# EAGLE design Laser Harp PCB (EAGLE 9.6.2)
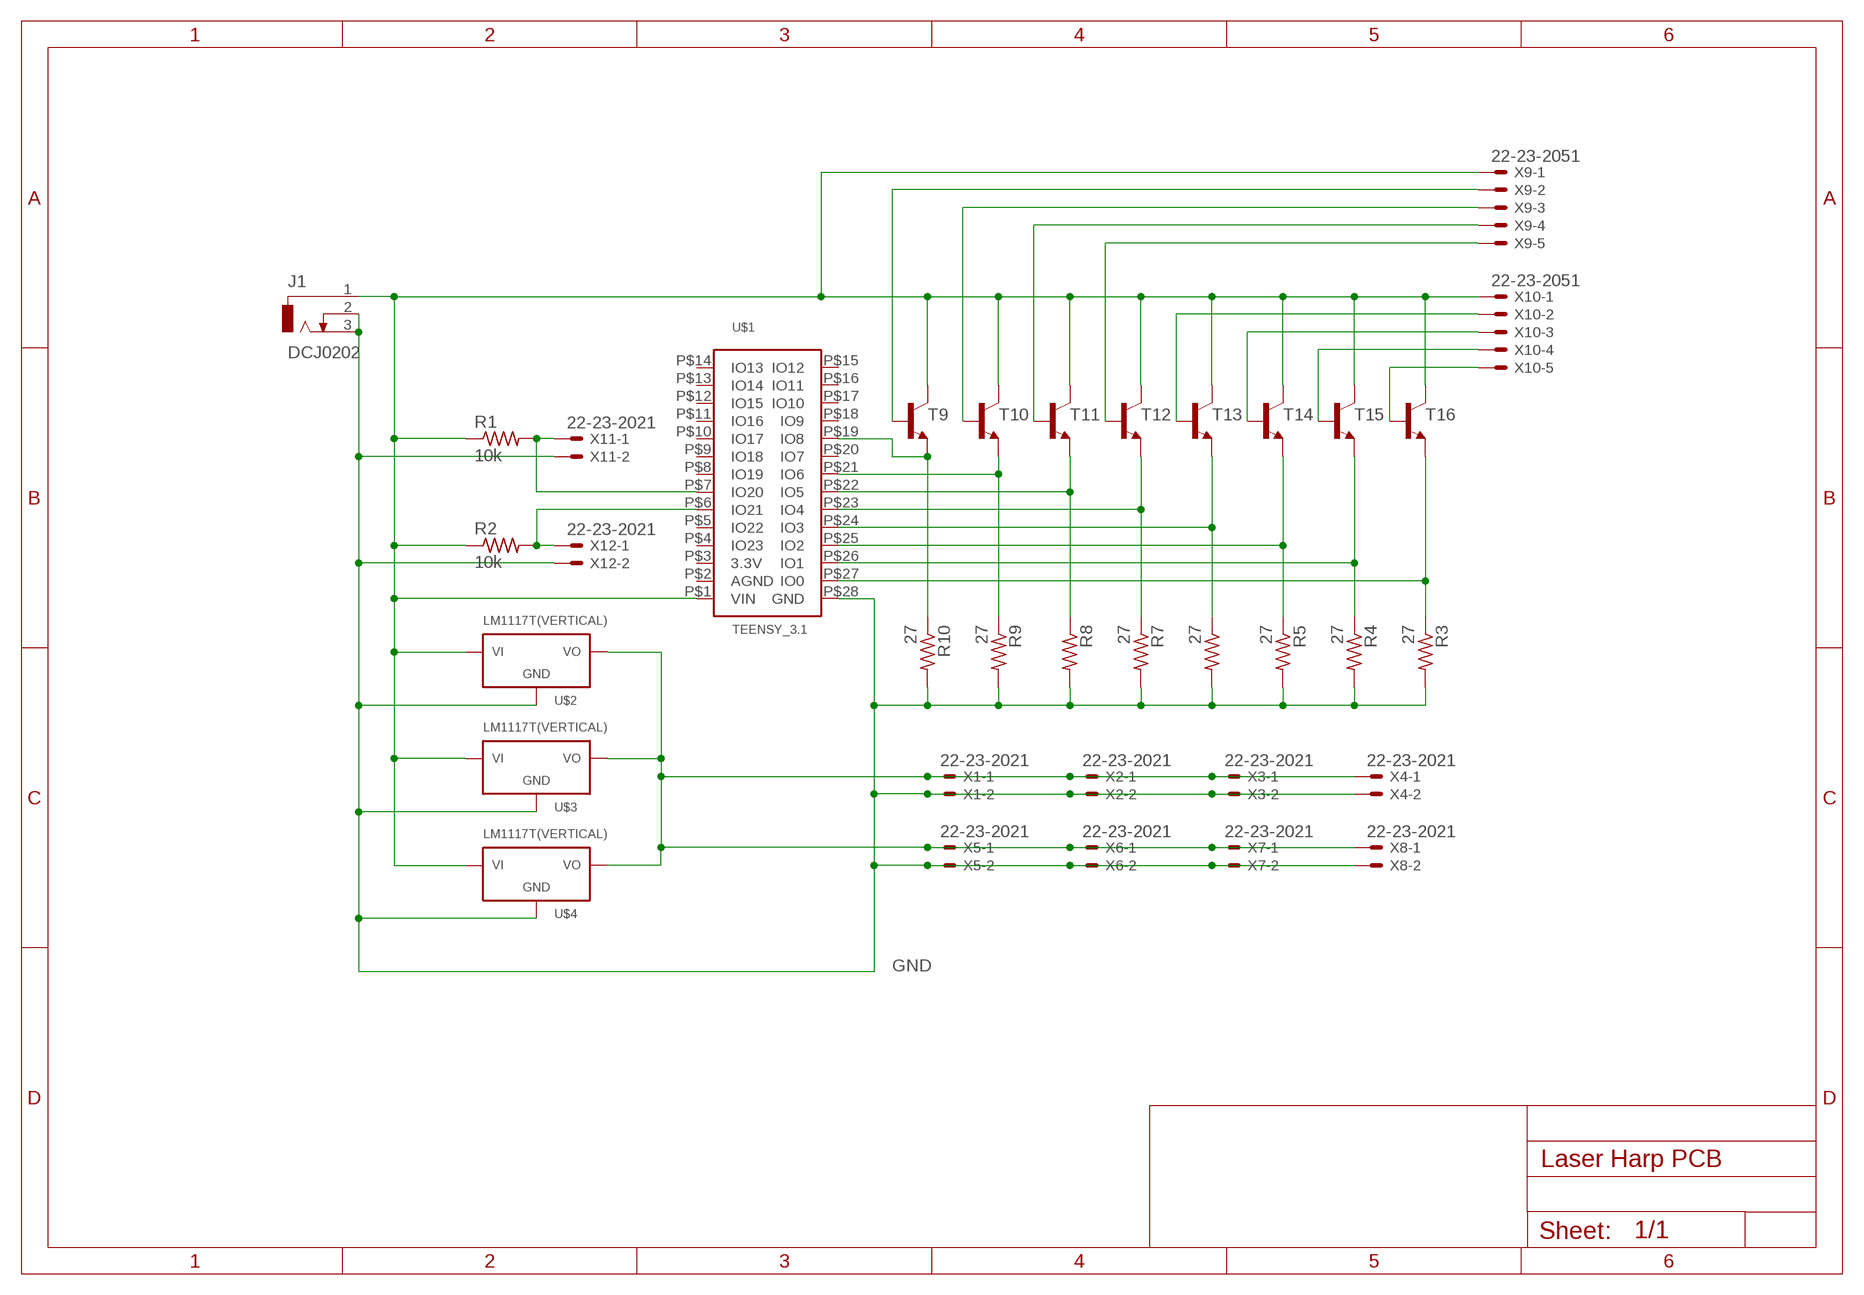
[diagram p0: schematic, sheet 1]

## Parts
J1  DCJ0202  [DCJ0202]
R1  10k  R-US_0207/7  [0207/7]
R2  10k  R-US_0207/7  [0207/7]
R3  27  R-US_0207/7  [0207/7]
R4  27  R-US_0207/7  [0207/7]
R5  27  R-US_0207/7  [0207/7]
R6  27  R-US_0207/7  [0207/7]
R7  27  R-US_0207/7  [0207/7]
R8  27  R-US_0207/7  [0207/7]
R9  27  R-US_0207/7  [0207/7]
R10  27  R-US_0207/7  [0207/7]
T9  2N3904-NPN-TO92-EBC  [TO92-EBC]
T10  2N3904-NPN-TO92-EBC  [TO92-EBC]
T11  2N3904-NPN-TO92-EBC  [TO92-EBC]
T12  2N3904-NPN-TO92-EBC  [TO92-EBC]
T13  2N3904-NPN-TO92-EBC  [TO92-EBC]
T14  2N3904-NPN-TO92-EBC  [TO92-EBC]
T15  2N3904-NPN-TO92-EBC  [TO92-EBC]
T16  2N3904-NPN-TO92-EBC  [TO92-EBC]
U$1  TEENSY_3.1  [TEENSY_3.1]
U$2  LM1117T(VERTICAL)  [317TS]
U$3  LM1117T(VERTICAL)  [317TS]
U$4  LM1117T(VERTICAL)  [317TS]
X1  22-23-2021  [22-23-2021]
X2  22-23-2021  [22-23-2021]
X3  22-23-2021  [22-23-2021]
X4  22-23-2021  [22-23-2021]
X5  22-23-2021  [22-23-2021]
X6  22-23-2021  [22-23-2021]
X7  22-23-2021  [22-23-2021]
X8  22-23-2021  [22-23-2021]
X9  22-23-2051  [22-23-2051]
X10  22-23-2051  [22-23-2051]
X11  22-23-2021  [22-23-2021]
X12  22-23-2021  [22-23-2021]

## Nets
GND: J1.2 J1.3 R3.2 R4.2 R5.2 R6.2 R7.2 R8.2 R9.2 R10.2 U$1.P$28(GND) U$2.1(GND) U$3.1(GND) U$4.1(GND) X1.2 X2.2 X3.2 X4.2 X5.2 X6.2 X7.2 X8.2 X11.2 X12.2
N$1: U$2.2(VOUT) U$3.2(VOUT) U$4.2(VOUT) X1.1 X2.1 X3.1 X4.1 X5.1 X6.1 X7.1 X8.1
N$2: J1.1 R1.1 R2.1 T9.C T10.C T11.C T12.C T13.C T14.C T15.C T16.C U$1.P$1(VIN) U$2.3(VIN) U$3.3(VIN) U$4.3(VIN) X9.1 X10.1
N$3: R3.1 T16.E U$1.P$27(IO0)
N$4: R4.1 T15.E U$1.P$26(IO1)
N$5: R5.1 T14.E U$1.P$25(IO2)
N$6: R6.1 T13.E U$1.P$24(IO3)
N$7: R7.1 T12.E U$1.P$23(IO4)
N$8: R8.1 T11.E U$1.P$22(IO5)
N$9: R9.1 T10.E U$1.P$21(IO6)
N$10: R2.2 U$1.P$6(IO21) X12.1
N$12: R1.2 U$1.P$7(IO20) X11.1
N$24: R10.1 T9.E U$1.P$19(IO8)
N$27: T9.B X9.2
N$28: T10.B X9.3
N$29: T11.B X9.4
N$30: T12.B X9.5
N$31: T13.B X10.2
N$32: T14.B X10.3
N$33: T15.B X10.4
N$34: T16.B X10.5
Unconnected: U$1.P$2(AGND) U$1.P$3(3.3V) U$1.P$4(IO23) U$1.P$5(IO22) U$1.P$8(IO19) U$1.P$9(IO18) U$1.P$10(IO17) U$1.P$11(IO16) U$1.P$12(IO15) U$1.P$13(IO14) U$1.P$14(IO13) U$1.P$15(IO12) U$1.P$16(IO11) U$1.P$17(IO10) U$1.P$18(IO9) U$1.P$20(IO7)

## Library data of the parts
J1 = con-jack:DCJ0202: DC POWER JACK Source: DCJ0202.pdf; OC_FARNELL: unknown; OC_NEWARK: unknown
R1-R10 = rcl:R-US_: RESISTOR, American symbol; SPICEPREFIX: R
T9-T16 = transistor-neu-to92:*-NPN-: NPN Transistror
U$1 = Laser Harp PCB:TEENSY_3.1
U$2-U$4 = Laser Harp PCB:LM1117T(VERTICAL)
X1-X8 X11 X12 = con-molex:22-23-2021: .100" (2.54mm) Center Header - 2 Pin; MF: MOLEX; MPN: 22-23-2021; OC_FARNELL: 1462926; OC_NEWARK: 25C3832
X9 X10 = con-molex:22-23-2051: .100" (2.54mm) Center Header - 5 Pin; MF: MOLEX; MPN: 22-23-2051; OC_FARNELL: 1462952; OC_NEWARK: 38C9178

## Board
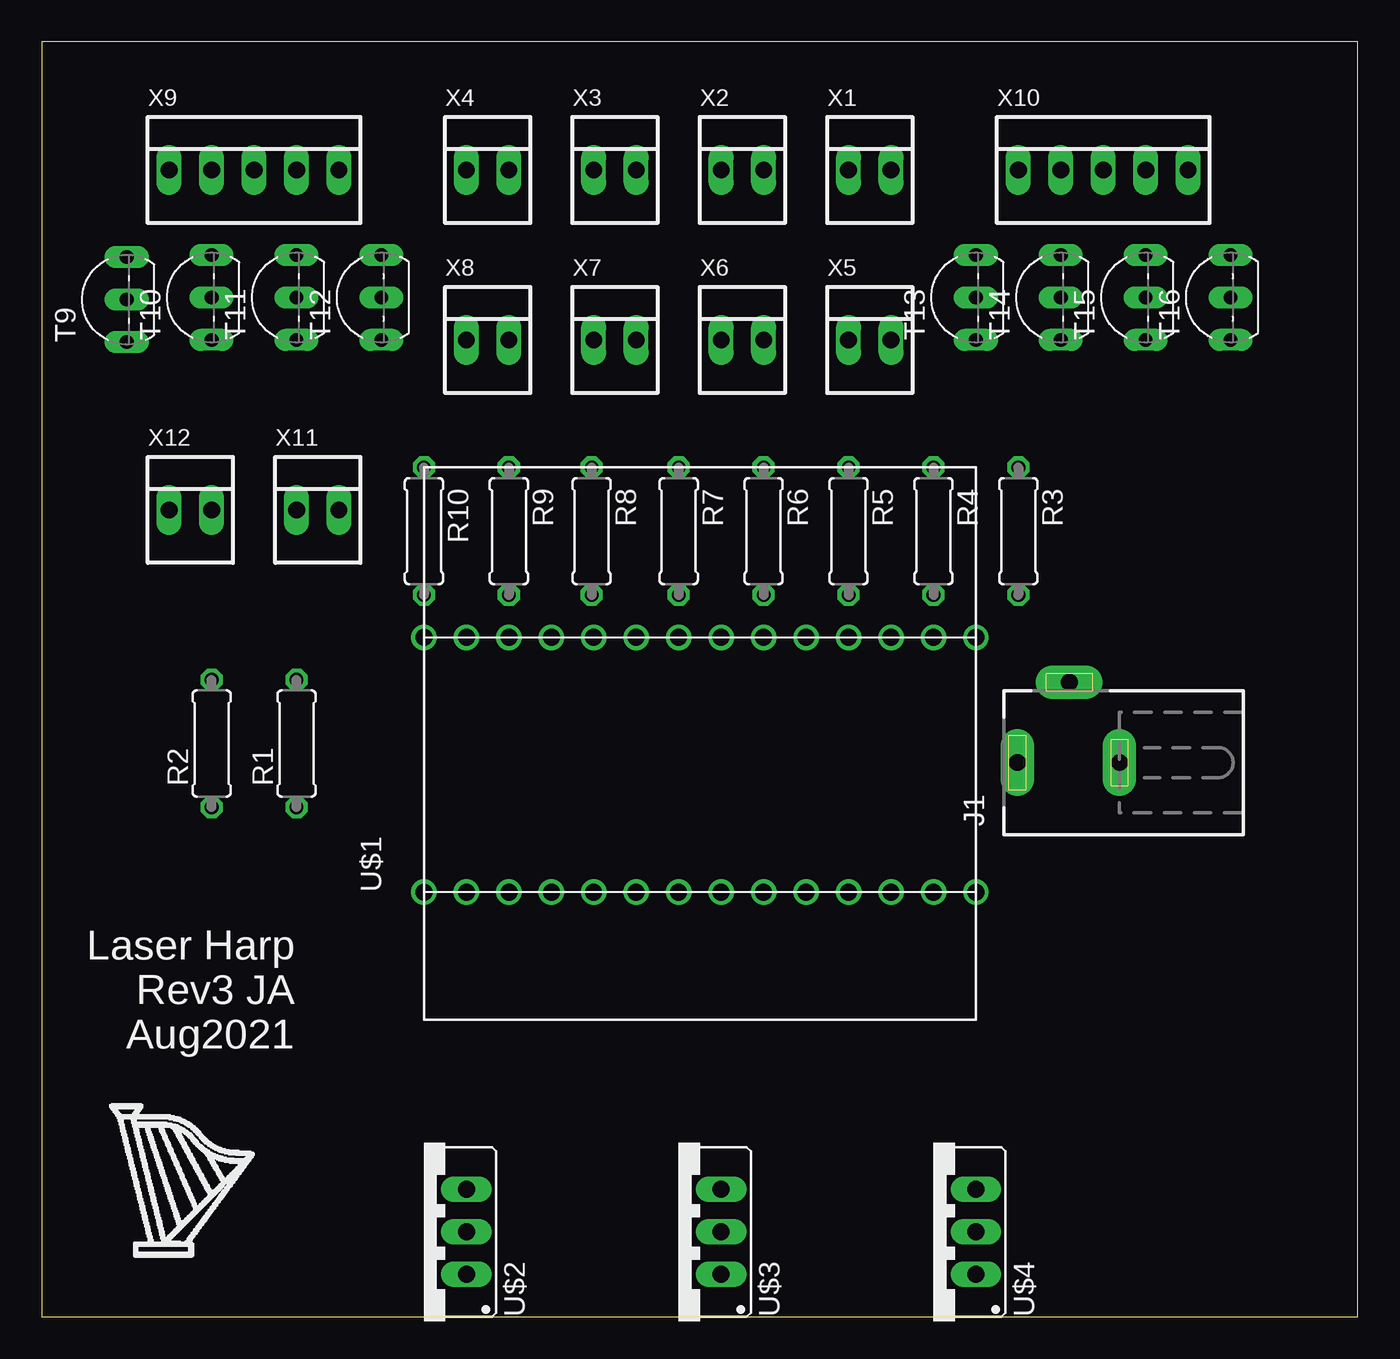
[diagram p1: board, top side]
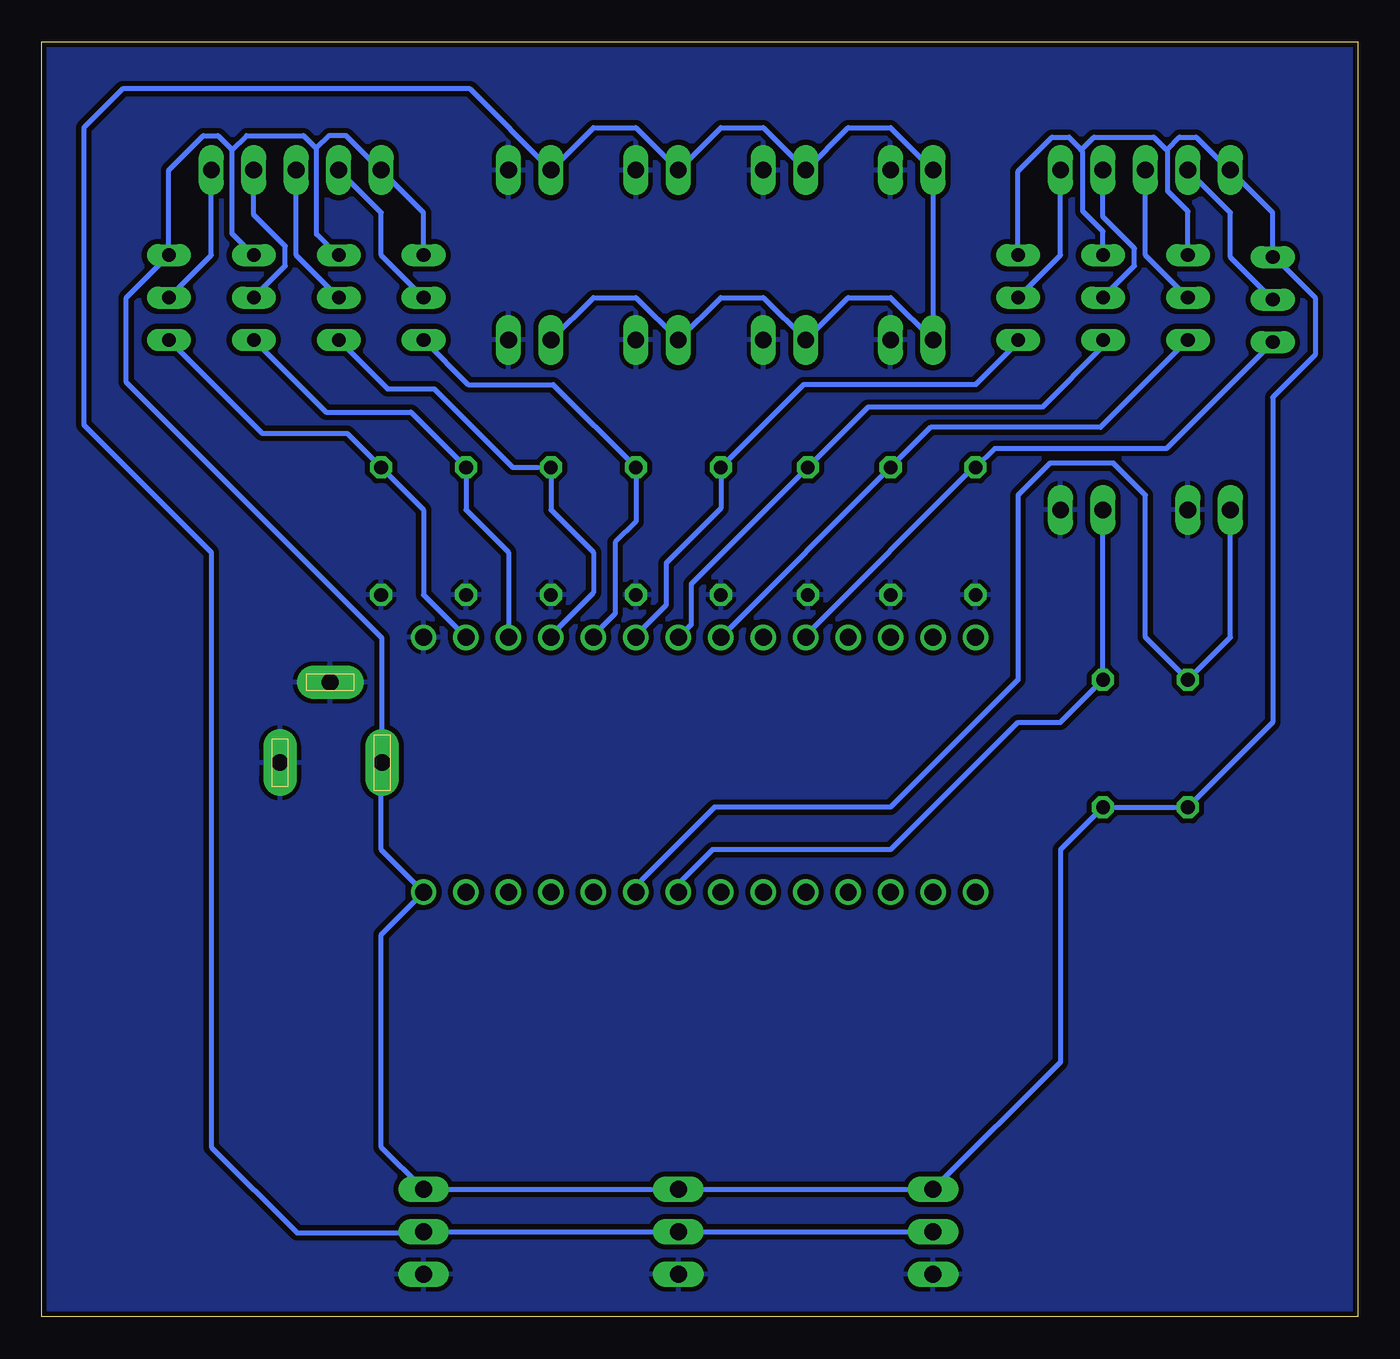
[diagram p2: board, bottom side, seen from below]

Size 78.72 x 76.25 mm. Coordinates in mm from the lower left corner, seen from the top.
Outline: 0,0 78.72,0 78.72,76.25 0,76.25 0,0
Copper layers (1*16): Top 0.035mm / dielectric 1.5mm / Bottom 0.035mm
Design rules "elcdrc": minimum track width 12mil, minimum drill 0.3mm, track to track 12mil, track to pad 12mil, pad to pad 12mil, via to via 12mil, smd to smd 6mil, copper to edge 12mil, drill to drill 12mil, minimum pad ring 10mil, minimum via ring 8mil, stop-mask expansion 4mil, vias tented up to drill 0mil, thermal gap 10mil

### Footprints (pad centres in the part's own frame; a part is rotated, then mirrored left to right if it is on the bottom)
DCJ0202 = drill 1 pad 2 long: 1 0,3.1; 2 4.8,0; 3 0,-3
0207/7 = drill 0.813 octagon: 1 -3.81,0; 2 3.81,0
TO92-EBC = drill 0.813 long: B 0,-1.27; C 2.54,-1.27; E -2.54,-1.27
TEENSY_3.1 = drill 1.016: P$1 0,0; P$2 0,2.54; P$3 0,5.08; P$4 0,7.62; P$5 0,10.16; P$6 0,12.7; P$7 0,15.24; P$8 0,17.78; P$9 0,20.32; P$10 0,22.86; P$11 0,25.4; P$12 0,27.94; P$13 0,30.48; P$14 0,33.02; P$15 15.24,33.02; P$16 15.24,30.48; P$17 15.24,27.94; P$18 15.24,25.4; P$19 15.24,22.86; P$20 15.24,20.32; P$21 15.24,17.78; P$22 15.24,15.24; P$23 15.24,12.7; P$24 15.24,10.16; P$25 15.24,7.62; P$26 15.24,5.08; P$27 15.24,2.54; P$28 15.24,0
317TS = drill 1.016 long: 1 -2.54,-2.54; 2 0,-2.54; 3 2.54,-2.54
22-23-2021 = drill 1 long: 1 -1.27,0; 2 1.27,0
22-23-2051 = drill 1 long: 1 -5.08,0; 2 -2.54,0; 3 0,0; 4 2.54,0; 5 5.08,0

### Placement (x,y rotation side)
J1  61.47,33.15 90 top
R1  15.24,34.29 90 top
R2  10.16,34.29 90 top
R3  58.42,46.99 270 top
R4  53.34,46.99 270 top
R5  48.26,46.99 270 top
R6  43.18,46.99 270 top
R7  38.1,46.99 270 top
R8  32.89,46.99 270 top
R9  27.94,46.99 270 top
R10  22.86,46.99 270 top
T9  3.81,60.83 90 top
T10  8.89,60.96 90 top
T11  13.97,60.96 90 top
T12  19.05,60.96 90 top
T13  54.61,60.96 90 top
T14  59.69,60.96 90 top
T15  64.77,60.96 90 top
T16  69.85,60.96 90 top
U$1  55.88,25.4 90 top
U$2  22.86,5.08 90 top
U$3  38.1,5.08 90 top
U$4  53.34,5.08 90 top
X1  49.53,68.58 0 top
X2  41.91,68.58 0 top
X3  34.29,68.58 0 top
X4  26.67,68.58 0 top
X5  49.53,58.42 0 top
X6  41.91,58.42 0 top
X7  34.29,58.42 0 top
X8  26.67,58.42 0 top
X9  12.7,68.58 0 top
X10  63.5,68.58 0 top
X11  16.51,48.26 0 top
X12  8.89,48.26 0 top

### Tracks (layer width: path | path; a pad name or v marks a point on that pad's centre or on a via)
GND
  pour Bottom: 0,76.2 0,0 78.74,0 78.74,76.2
N$1
  Bottom 0.305: X5.1 45.72,60.96 43.18,60.96 X6.1 38.1,60.96 35.56,60.96 X7.1 30.48,60.96 27.94,60.96 X8.1 X4.1 27.94,71.12 30.48,71.12 X3.1 35.56,71.12 38.1,71.12 X2.1 43.18,71.12 45.72,71.12 X1.1 53.11,73.43 73.89,73.43 76.2,71.12 76.2,53.34 68.58,45.72 68.58,10.16 63.45,5.03 55.93,5.03 U$4.2 U$3.2 U$2.2
N$2
  Bottom 0.305: T13.C 55.88,66.04 X10.1 58.45,68.58 60.52,70.65 61.53,70.65 62.29,69.88 | 67.35,69.77 66.48,70.65 63.06,70.65 62.29,69.88 | 67.35,69.77 67.35,64.8 66.06,63.5 T15.C | 62.29,69.88 62.29,69.84 62.29,64.74 61.05,63.5 T14.C | 67.35,69.77 67.37,69.79 67.37,69.84 68.18,70.65 69.05,70.65 71.12,68.58 T16.C 73.66,60.96 73.66,55.88 58.37,40.59 J1.1 58.42,33.09 58.42,27.94 U$1.P$1 58.42,22.86 58.42,10.16 U$4.3 U$3.3 U$2.3 17.78,15.24 17.78,27.94 R1.1 R2.1 5.08,35.56 5.08,54.99 2.54,57.53 2.54,60.96 4.95,63.37 T9.C 5.08,66.04 X9.1 7.69,68.58 9.66,70.55 10.66,70.55 11.37,69.84 | 11.37,69.84 11.37,67.32 10.16,66.11 T10.C | 11.37,69.84 11.49,69.84 12.2,70.55 15.78,70.55 16.55,69.77 | T11.C 15.24,64.92 16.45,66.13 16.45,69.67 16.55,69.77 | 16.55,69.77 16.57,69.79 16.57,69.84 17.28,70.55 18.28,70.55 20.32,68.51 T12.C
N$3
  Bottom 0.305: T16.E 65.53,52.83 60.45,52.83 R3.1 55.88,48.26 55.88,43.18 U$1.P$27
N$4
  Bottom 0.305: T15.E 61.72,54.1 56.64,54.1 R4.1 53.34,48.26 50.8,45.72 U$1.P$26
N$5
  Bottom 0.305: T14.E 58.04,55.5 55.24,55.5 50.55,50.8 R5.1 48.26,48.26 45.72,45.72 45.72,43.31 48.26,40.77 U$1.P$25
N$6
  Bottom 0.305: T13.E 53.21,55.75 48.13,55.75 R6.1 43.18,47.55 44.42,46.31 44.42,42.06 45.72,40.77 U$1.P$24
N$7
  Bottom 0.305: T12.E 20.32,58.29 22.86,55.75 33.15,55.75 R7.1 38.1,48.36 41.38,45.08 41.38,42.57 43.18,40.77 U$1.P$23
N$8
  Bottom 0.305: T11.E 15.24,58.04 18.87,54.41 29.29,54.41 R8.1 39.88,43.81 39.88,41.4 U$1.P$22
N$9
  Bottom 0.305: T10.E 15.39,53.19 25.55,53.19 R9.1 U$1.P$21
N$10
  Bottom 0.305: U$1.P$6 43.18,25.78 38.48,30.48 27.94,30.48 20.32,38.1 20.32,49.15 18.41,51.05 14.61,51.05 12.7,49.15 12.7,40.64 R2.2 7.62,40.64 X12.1
N$12
  Bottom 0.305: U$1.P$7 40.64,25.91 38.61,27.94 27.94,27.94 20.32,35.56 17.78,35.56 R1.2 X11.1
N$24
  Bottom 0.305: T9.E 11.43,51.94 21.72,51.94 R10.1 22.99,50.8 33.02,40.77 U$1.P$19
N$27
  Bottom 0.305: T9.B 7.62,63.37 7.62,66.04 X9.2
N$28
  Bottom 0.305: T10.B 12.7,63.5 X9.3
N$29
  Bottom 0.305: T11.B 13.36,62.85 13.36,63.9 15.24,65.78 X9.4
N$30
  Bottom 0.305: T12.B 17.78,63.5 X9.5
N$31
  Bottom 0.305: T13.B 58.42,63.5 58.42,66.04 X10.2
N$32
  Bottom 0.305: T14.B 63.5,63.5 X10.3
N$33
  Bottom 0.305: T15.B 64.16,62.85 64.16,64.03 66.04,65.91 X10.4
N$34
  Bottom 0.305: T16.B 68.58,63.5 X10.5

### Text on the board
tPlace: Laser Harp / Rev3 JA / Aug2021